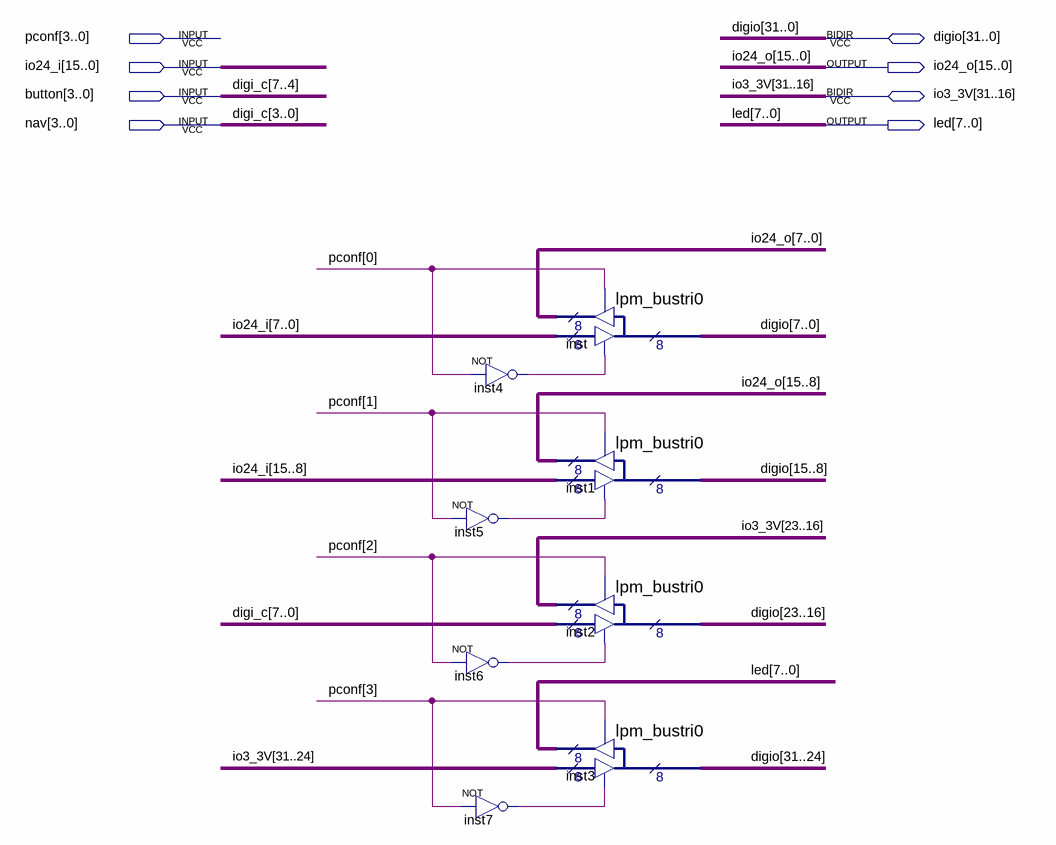
[diagram p0: schematic sheet]
// Quartus schematic digital_io.bdf as structural Verilog: 8 symbols, 8 pins
module digital_io (
  input  [3:0] pconf,
  input  [15:0] io24_i,
  input  [3:0] button,
  input  [3:0] nav,
  inout  [31:0] digio,
  inout  [31:16] io3_3V,
  output [15:0] io24_o,
  output [7:0] led
);

  wire inst4_out, inst5_out, inst6_out, inst7_out;

  not inst4 (inst4_out, pconf[0]);
  not inst5 (inst5_out, pconf[1]);
  not inst6 (inst6_out, pconf[2]);
  not inst7 (inst7_out, pconf[3]);
  lpm_bustri0 inst (
    .enabledt(inst4_out), .data(io24_i[7:0]), .enabletr(pconf[0]), .result(io24_o[7:0]), .tridata(digio[7:0]));
  lpm_bustri0 inst1 (
    .enabledt(inst5_out), .data(io24_i[15:8]), .enabletr(pconf[1]), .result(io24_o[15:8]),
    .tridata(digio[15:8]));
  lpm_bustri0 inst2 (
    .enabledt(inst6_out), .data({button, nav}), .enabletr(pconf[2]), .result(io3_3V[23:16]),
    .tridata(digio[23:16]));
  lpm_bustri0 inst3 (
    .enabledt(inst7_out), .data(io3_3V[31:24]), .enabletr(pconf[3]), .result(led), .tridata(digio[31:24]));

  // Other names for the same wires on the sheet: digi_c[7:0] = {button, nav}
endmodule
